# Altium schematic sheet root.SchDoc
size A; SheetNumber: 1; SheetTotal: 4
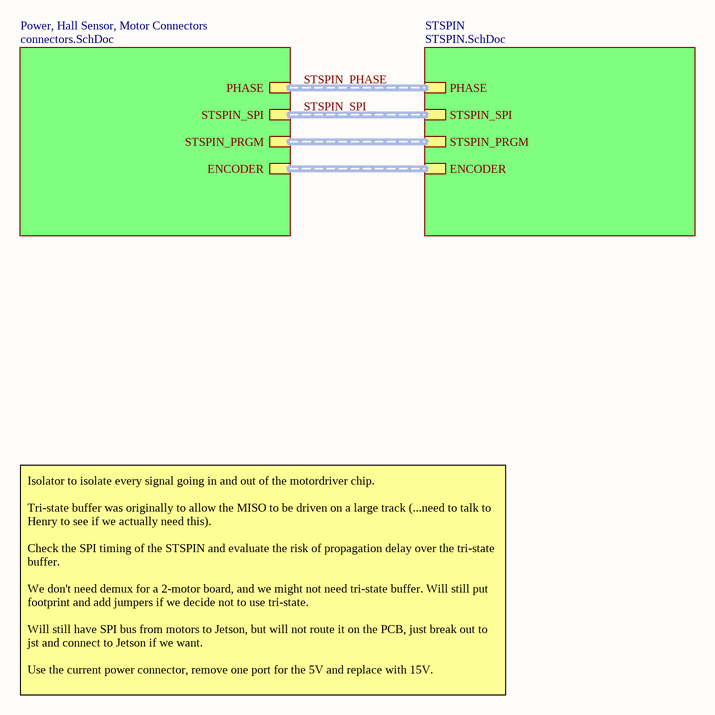
[diagram p0: root.SchDoc]

## Sub-sheets
Power, Hall Sensor, Motor Connectors = connectors.SchDoc: STSPIN_SPI (harness STSPIN_SPI), PHASE, STSPIN_PRGM, ENCODER
STSPIN = STSPIN.SchDoc: STSPIN_SPI (harness STSPIN_SPI), PHASE, STSPIN_PRGM, ENCODER

## Buses and harness runs
harness sheet Power, Hall Sensor, Motor Connectors/ENCODER = sheet STSPIN/ENCODER
harness sheet Power, Hall Sensor, Motor Connectors/STSPIN_PRGM = sheet STSPIN/STSPIN_PRGM
harness STSPIN_PHASE = sheet Power, Hall Sensor, Motor Connectors/PHASE = sheet STSPIN/PHASE
harness STSPIN_SPI = sheet Power, Hall Sensor, Motor Connectors/STSPIN_SPI = sheet STSPIN/STSPIN_SPI

## Notes on the sheet
- Isolator to isolate every signal going in and out of the motordriver chip.
  Tri-state buffer was originally to allow the MISO to be driven on a large track (...need to talk to Henry to see if we actually need this).
  Check the SPI timing of the STSPIN and evaluate the risk of propagation delay over the tri-state buffer.
  We don't need demux for a 2-motor board, and we might not need tri-state buffer. Will still put footprint and add jumpers if we decide not to use tri-state.
  Will still have SPI bus from motors to Jetson, but will not route it on the PCB, just break out to jst and connect to Jetson if we want.
  Use the current power connector, remove one port for the 5V and replace with 15V.